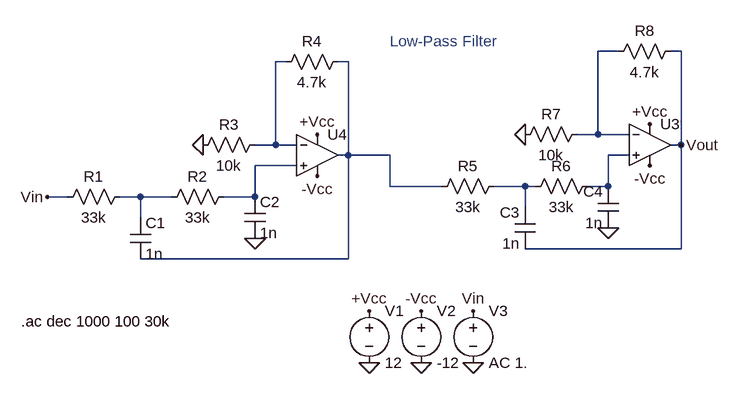
[diagram p0: schematic lpf.asc]
lpf.asc, the LTspice schematic file:
Version 4
SHEET 1 1112 1156
WIRE 656 640 624 640
WIRE 752 640 736 640
WIRE 144 656 128 656
WIRE 240 656 224 656
WIRE 624 768 624 640
WIRE 624 768 592 768
WIRE 672 768 624 768
WIRE 128 784 128 656
WIRE 128 784 96 784
WIRE 160 784 128 784
WIRE 752 784 752 640
WIRE 752 784 736 784
WIRE 240 800 240 656
WIRE 240 800 224 800
WIRE 304 800 240 800
WIRE 672 800 640 800
WIRE 160 816 96 816
WIRE 304 848 304 800
WIRE 384 848 304 848
WIRE 512 848 464 848
WIRE 528 848 512 848
WIRE 640 848 640 800
WIRE 640 848 608 848
WIRE -192 864 -224 864
WIRE -80 864 -112 864
WIRE -32 864 -80 864
WIRE 96 864 96 816
WIRE 96 864 48 864
WIRE 512 880 512 848
WIRE -80 896 -80 864
WIRE 752 944 752 784
WIRE 752 944 512 944
WIRE 240 960 240 800
WIRE 240 960 -80 960
FLAG 352 1120 0
FLAG 272 1120 0
FLAG 432 1120 0
FLAG 272 1040 +Vcc
FLAG 352 1040 -Vcc
FLAG 432 1040 Vin
FLAG 640 912 0
FLAG 512 768 0
FLAG 16 784 0
FLAG 96 928 0
FLAG 192 768 +Vcc
FLAG 192 832 -Vcc
FLAG 704 752 +Vcc
FLAG 704 816 -Vcc
FLAG -224 864 Vin
FLAG 752 784 Vout
SYMBOL voltage 272 1024 R0
WINDOW 123 0 0 Left 0
WINDOW 39 0 0 Left 0
SYMATTR InstName V1
SYMATTR Value 12
SYMBOL voltage 352 1024 R0
WINDOW 123 0 0 Left 0
WINDOW 39 0 0 Left 0
SYMATTR InstName V2
SYMATTR Value -12
SYMBOL voltage 432 1024 R0
WINDOW 123 0 0 Left 0
WINDOW 39 0 0 Left 0
SYMATTR InstName V3
SYMATTR Value AC 1.
SYMBOL OpAmps\\UniversalOpAmp 704 784 R0
SYMATTR InstName U3
SYMBOL res 752 624 R90
WINDOW 0 0 56 VBottom 2
WINDOW 3 32 56 VTop 2
SYMATTR InstName R8
SYMATTR Value 4.7k
SYMBOL res 512 864 R270
WINDOW 0 32 56 VTop 2
WINDOW 3 0 56 VBottom 2
SYMATTR InstName R6
SYMATTR Value 33k
SYMBOL cap 656 912 R180
WINDOW 0 24 56 Left 2
WINDOW 3 24 8 Left 2
SYMATTR InstName C4
SYMATTR Value 1n
SYMBOL res 608 752 R90
WINDOW 0 0 56 VBottom 2
WINDOW 3 32 56 VTop 2
SYMATTR InstName R7
SYMATTR Value 10k
SYMBOL res 368 864 R270
WINDOW 0 32 56 VTop 2
WINDOW 3 0 56 VBottom 2
SYMATTR InstName R5
SYMATTR Value 33k
SYMBOL cap 528 944 R180
WINDOW 0 24 56 Left 2
WINDOW 3 24 8 Left 2
SYMATTR InstName C3
SYMATTR Value 1n
SYMBOL OpAmps\\UniversalOpAmp 192 800 R0
SYMATTR InstName U4
SYMBOL res 240 640 R90
WINDOW 0 0 56 VBottom 2
WINDOW 3 32 56 VTop 2
SYMATTR InstName R4
SYMATTR Value 4.7k
SYMBOL res 112 768 R90
WINDOW 0 0 56 VBottom 2
WINDOW 3 32 56 VTop 2
SYMATTR InstName R3
SYMATTR Value 10k
SYMBOL res 64 848 R90
WINDOW 0 0 56 VBottom 2
WINDOW 3 32 56 VTop 2
SYMATTR InstName R2
SYMATTR Value 33k
SYMBOL cap 80 864 R0
SYMATTR InstName C2
SYMATTR Value 1n
SYMBOL res -96 848 R90
WINDOW 0 0 56 VBottom 2
WINDOW 3 32 56 VTop 2
SYMATTR InstName R1
SYMATTR Value 33k
SYMBOL cap -96 896 R0
SYMATTR InstName C1
SYMATTR Value 1n
TEXT -264 1056 Left 2 !.ac dec 1000 100 30k
TEXT 304 624 Left 2 ;Low-Pass Filter

The netlist it stands for:
* lpf.asc
V1 +Vcc 0 12
V2 -Vcc 0 -12
V3 Vin 0 AC 1.
XU3 N004 N001 +Vcc -Vcc Vout level1 Avol=1Meg GBW=10Meg Vos=0 En=0 Enk=0 In=0 Ink=0 Rin=500Meg  ; pins In+ In- V+ V- OUT
R8 Vout N001 4.7k
R6 N006 N004 33k
C4 0 N004 1n
R7 N001 0 10k
R5 N003 N006 33k
C3 Vout N006 1n
XU4 N005 N002 +Vcc -Vcc N003 level1 Avol=1Meg GBW=10Meg Vos=0 En=0 Enk=0 In=0 Ink=0 Rin=500Meg  ; pins In+ In- V+ V- OUT
R4 N003 N002 4.7k
R3 N002 0 10k
R2 N005 N007 33k
C2 N005 0 1n
R1 N007 Vin 33k
C1 N007 N003 1n
.ac dec 1000 100 30k
* Low-Pass Filter
.lib UniversalOpAmp1.lib
.backanno
.end